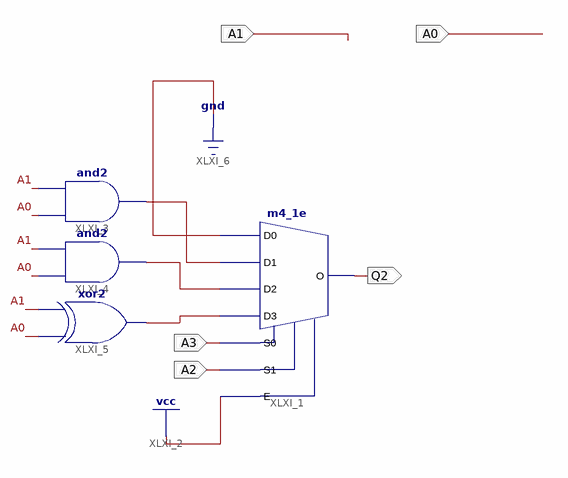
[diagram p0: schematic sheet 1]
// Xilinx ISE schematic q2.sch (spartan3) as structural Verilog: 4 symbols, 5 ports
module q2 (
  input  A3,
  input  A2,
  input  A1,
  input  A0,
  output Q2
);

  wire XLXN_7, XLXN_8, XLXN_9;

  m4_1e XLXI_1 (.D0(1'b0), .D1(XLXN_9), .D2(XLXN_8), .D3(XLXN_7), .E(1'b1), .S0(A3), .S1(A2), .O(Q2));
  and XLXI_3 (XLXN_9, A0, A1);
  and XLXI_4 (XLXN_8, A0, A1);
  xor XLXI_5 (XLXN_7, A0, A1);
endmodule
